# Altium schematic sheet Charging_sch.SchDoc
size A4; SheetNumber: 1; SheetTotal: 1
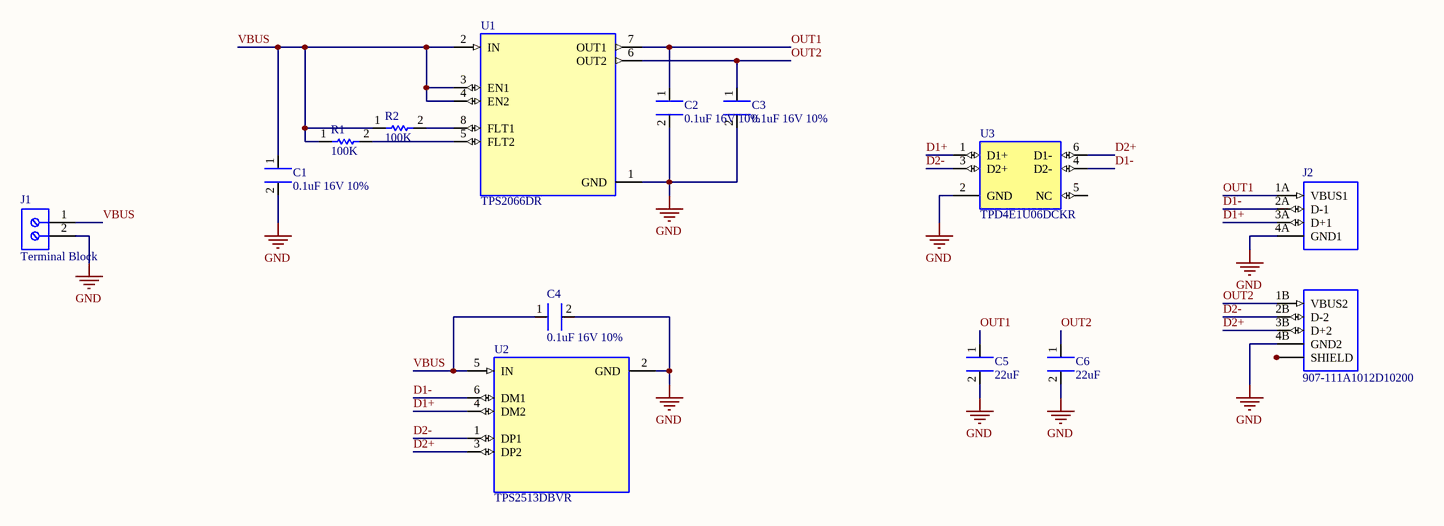
[diagram p0: Charging_sch.SchDoc]

## Parts
C1  0.1uF 16V 10%  [CC0805KRX7R9BB104]
C2  0.1uF 16V 10%  [CC0805KRX7R9BB104]
C3  0.1uF 16V 10%  [CC0805KRX7R9BB104]
C4  0.1uF 16V 10%  [CC0805KRX7R9BB104]
C5  22uF  [RVT1C220M0405]
C6  22uF  [RVT1C220M0405]
J1  Terminal Block  [Terminal Block]
J2  907-111A1012D10200  [907-111A1012D10200]
R1  100K  [ARG05FTC1003]
R2  100K  [ARG05FTC1003]
U1  TPS2066DR  [TPS2066DR]
U2  TPS2513DBVR  [TPS2513DBVR]
U3  TPD4E1U06DCKR  [TPD4E1U06DCKR]

## Nets
GND: C1.2 C2.2 C3.2 C4.2 C5.2 C6.2 J1.2 J2.4A(GND1) J2.4B(GND2) U1.1(GND) U2.2(GND) U3.2(GND)
D1+: J2.3A(D+1) U2.4(DM2) U3.1(D1+)
D1-: J2.2A(D-1) U2.6(DM1) U3.4(D2-)
D2+: J2.3B(D+2) U2.3(DP2) U3.6(D1-)
D2-: J2.2B(D-2) U2.1(DP1) U3.3(D2+)
OUT1: C2.1 C5.1 J2.1A(VBUS1) U1.7(OUT1)
OUT2: C3.1 C6.1 J2.1B(VBUS2) U1.6(OUT2)
VBUS: C1.1 C4.1 J1.1 R1.1 R2.1 U1.2(IN) U1.3(EN1) U1.4(EN2) U2.5(IN)
NetJ2_9: J2.9(SHIELD) J2.10(SHIELD) J2.11(SHIELD) J2.12(SHIELD)
NetR1_2: R1.2 U1.5(FLT2)
NetR2_2: R2.2 U1.8(FLT1)

Not connected (* = marked no-connect by the designer): U3 5(NC)

## Library data of the parts
C1-C4 = CC0805KRX7R9BB104: 贴片电容（MLCC） 100nF ±10% 50V X7R 0805; Manufacturer: Yageo; Material: Ceramic; Insulation Resistance: 100GR; Supplier 1: Digi-Key; Manufacturer Part Number: CC0805KRX7R9BB104; RoHS: Yes; Category: Ceramic Capacitors; Stock 1: 10785221; Pricing 1: 4000=0.01864, 8000=0.01734, 12000=0.01647, 28000=0.01560, 100000=0.01181 (USD); Mount: Surface Mount; Case/Package: 0805; Number of Pins: 2; Case Code (Metric): 2012; Case Code (Imperial): 0805; Min Operating Temperature: -55°C; Max Operating Temperature: 125°C; Tolerance: 10%; Dielectric: X7R; Capacitance: 100nF; Voltage: 50V; Packaging: Tape and Reel; Voltage Rating: 50V; Package Quantity: 1; Termination: SMD/SMT; Series: CC; Length: 2mm; Width: 0.049inch; Height: 0.85mm; Depth: 1.25mm; Thickness: 0.033inch; Radiation Hardening: No; RoHS Compliant: Yes; REACH SVHC: No SVHC; Lead Free: Lead Free; Halogen Free: Halogen Free; ComponentLink1URL: https://datasheet.ciiva.com/11786/0900766b80d84f1d-11786009.pdf?src-supplier=RSComponents; ComponentLink1Description: https://datasheet.ciiva.com/11786/0900766b80d84f1d-11786009.pdf?src-supplier=RSComponents; ComponentLink2URL: https://datasheet.ciiva.com/28450/1489800-28450805.pdf?src-supplier=Element14; ComponentLink2Description: https://datasheet.ciiva.com/28450/1489800-28450805.pdf?src-supplier=Element14; ComponentLink3URL: https://datasheet.ciiva.com/46393/1734573-46393307.pdf?src-supplier=Element14; ComponentLink3Description: https://datasheet.ciiva.com/46393/1734573-46393307.pdf?src-supplier=Element14; ComponentLink4URL: https://datasheet.ciiva.com/155/mlccorderingcode-155930.pdf?src-supplier=Digi-Key; ComponentLink4Description: https://datasheet.ciiva.com/155/mlccorderingcode-155930.pdf?src-supplier=Digi-Key; ComponentLink5URL: https://datasheet.ciiva.com/155/mlccorderingcode-155929.pdf?src-supplier=Digi-Key; ComponentLink5Description: https://datasheet.ciiva.com/155/mlccorderingcode-155929.pdf?src-supplier=Digi-Key; ComponentLink6URL: https://datasheet.ciiva.com/155/mlccorderingcode-155931.pdf?src-supplier=Digi-Key; ComponentLink6Description: https://datasheet.ciiva.com/155/mlccorderingcode-155931.pdf?src-supplier=Digi-Key; ComponentLink7URL: https://datasheet.ciiva.com/11464/upy-gphc-x7r-6-3v-to-50v-8-11464757.pdf?src-supplier=Avnet; ComponentLink7Description: https://datasheet.ciiva.com/11464/upy-gphc-x7r-6-3v-to-50v-8-11464757.pdf?src-supplier=Avnet; ComponentLink8URL: https://datasheet.ciiva.com/16625/upy-gphc-x7r-6-3v-to-50v-8-16625549.pdf?src-supplier=Avnet+Europe; ComponentLink8Description: https://datasheet.ciiva.com/16625/upy-gphc-x7r-6-3v-to-50v-8-16625549.pdf?src-supplier=Avnet+Europe; ComponentLink9URL: https://datasheet.ciiva.com/29242/445210-da-01-en-kerko-chip-0805-x7r-0-1uf-10proz-50vg-29242074.pdf?src-supplier=Conrad; ComponentLink9Description: https://datasheet.ciiva.com/29242/445210-da-01-en-kerko-chip-0805-x7r-0-1uf-10proz-50vg-29242074.pdf?src-supplier=Conrad; Supplier Part Number 1: 311-1140-2-ND
C5 C6 = RVT1C220M0405: Manufacturer: ROQANG; Capacitance: 22uF; Manufacturer Part Number: RVT1C220M0405
J1 = 691709710302: Conn Terminal Block F 2 POS 5mm Solder RA SMD 6A T/R; Manufacturer: Wurth Electronics Midcom; Plating: Steel; Voltage Rating: 300V; Number of Levels: 1; Number of Positions Per Level: 2; Connector Type: Screw; Wire Gauge (Max): 30AWG; Wire Gauge (Min): 14AWG; Pitch: 0.197inch; Supplier 1: Digi-Key; Manufacturer Part Number: 691709710302; RoHS: Yes; Category: Terminal Blocks; Stock 1: 1256; Pricing 1: 1=2.89000, 10=2.56200, 50=2.41200, 100=2.26000 (USD); Mount: Surface Mount; Color: Black; Contact Plating: Tin; Housing Material: Nylon; Min Operating Temperature: -40°C; Max Operating Temperature: 115°C; Package Quantity: 1; Packaging: Tape and Reel; Current Rating: 6A; Current: 6A; Voltage: 300V; Termination: Screw; Number of Positions: 2; Number of Contacts: 2; Wire/Cable Gauge: 30AWG; REACH SVHC: Unknown; Flammability Rating: UL94 V-0; RoHS Compliant: Yes; ComponentLink1URL: http://www.mouser.com/ds/2/445/6917097103xx-271684.pdf?src-supplier=Mouser; ComponentLink1Description: http://www.mouser.com/ds/2/445/6917097103xx-271684.pdf?src-supplier=Mouser; ComponentLink2URL: http://katalog.we-online.de/em/datasheet/6917097103xx.pdf?src-supplier=Digi-Key; ComponentLink2Description: http://katalog.we-online.de/em/datasheet/6917097103xx.pdf?src-supplier=Digi-Key; ComponentLink3URL: https://katalog.we-online.de/em/datasheet/6917097103xx.pdf?src-supplier=Digi-Key; ComponentLink3Description: https://katalog.we-online.de/em/datasheet/6917097103xx.pdf?src-supplier=Digi-Key; ComponentLink4URL: http://www.farnell.com/cad/1804164.pdf?src-supplier=Element14; ComponentLink4Description: http://www.farnell.com/cad/1804164.pdf?src-supplier=Element14; Supplier Part Number 1: 1297-1108-1-ND
J2 = 907-111A1012D10200: USB1035 Series 8 Position Dual Port Through Hole USB; Manufacturer: Jing Extension of the Electronic Co.; Supplier 1: Digi-Key; Manufacturer Part Number: 907-111A1012D10200; RoHS: Yes; Category: USB Connectors; Contact Material: Brass; Contact Plating: Gold; Orientation: Right Angle; Connector Type: USB; RoHS Compliant: Yes; Supplier Part Number 1: 2073-USB1035-GF-P-0-B-B-ND
R1 R2 = ARG05FTC1003: Manufacturer: Viking Tech; Voltage Rating: 100V; Resistance: 100K; Manufacturer part number: ARG05FTC1003
U1 = TPS2066DR: Dual 1A, active-high, current-limited, power-distribution switches 8-SOIC -40 to 85; Manufacturer: Texas Instruments; Number of Outputs: 2; Min Supply Voltage: 2.7V; Max Supply Voltage: 5.5V; Interface: On/Off; Fault Protection: Over Temperature; Output Configuration: High Side; Supplier 1: Digi-Key; Manufacturer Part Number: TPS2066DR; RoHS: Yes; Category: Hot Swap Controllers; Stock 1: 1325; Pricing 1: 1=1.61000, 10=1.44400, 25=1.36200, 100=1.16050, 250=1.08968, 500=0.95348, 1000=0.89950 (USD); Case/Package: D; Number of Pins: 8; Weight: 0.002561oz; Min Operating Temperature: -40°C; Max Operating Temperature: 85°C; Packaging: Tape and Reel; Package Quantity: 2500; Max Input Voltage: 5.5V; Min Input Voltage: 2.7V; Series: -; Number of Switches: 2; Max Output Current: 1A; Radiation Hardening: No; Lead Free: Lead Free; RoHS Compliant: Yes; ComponentLink1URL: https://datasheet.ciiva.com/15108/getdatasheetpartid-322117-15108532.pdf?src-supplier=Verical; ComponentLink1Description: https://datasheet.ciiva.com/15108/getdatasheetpartid-322117-15108532.pdf?src-supplier=Verical; ComponentLink2URL: https://datasheet.ciiva.com/1962/tps2061-1962580.pdf?src-supplier=Digi-Key; ComponentLink2Description: https://datasheet.ciiva.com/1962/tps2061-1962580.pdf?src-supplier=Digi-Key; ComponentLink3URL: https://datasheet.ciiva.com/1962/tps2061-1962581.pdf?src-supplier=Digi-Key; ComponentLink3Description: https://datasheet.ciiva.com/1962/tps2061-1962581.pdf?src-supplier=Digi-Key; ComponentLink4URL: https://datasheet.ciiva.com/1962/tps2061-1962582.pdf?src-supplier=Digi-Key; ComponentLink4Description: https://datasheet.ciiva.com/1962/tps2061-1962582.pdf?src-supplier=Digi-Key; Supplier Part Number 1: 296-28004-1-ND
U2 = TPS2513DBVR: USB Charging Port Controller Dual 5.5V 6-Pin SOT-23 T/R / IC USB PWR SW/CTRLR CHRG SOT23-6; Manufacturer: Texas Instruments; Min Input Voltage: 4.5V; Output Current: 35mA; Operating Supply Current: 155uA; Number of Outputs: 2; Max Supply Current: 200uA; Supplier 1: Digi-Key; Manufacturer Part Number: TPS2513DBVR; RoHS: Yes; Category: Power Management ICs; Pricing 1: 1=1.79000, 10=1.60700, 25=1.51600, 100=1.29150, 250=1.21264, 500=1.06106, 1000=1.00100 (USD); Mount: Surface Mount; Case/Package: SOT-23-6; Number of Pins: 6; Min Operating Temperature: -40°C; Max Operating Temperature: 125°C; Packaging: Tape and Reel; Package Quantity: 3000; Max Input Voltage: 5.5V; Operating Supply Voltage: 5.5V; Radiation Hardening: No; Lead Free: Lead Free; RoHS Compliant: Yes; ComponentLink1URL: https://datasheet.ciiva.com/29590/tps2514a-29590179.pdf?src-supplier=Digi-Key; ComponentLink1Description: https://datasheet.ciiva.com/29590/tps2514a-29590179.pdf?src-supplier=Digi-Key; ComponentLink2URL: https://datasheet.ciiva.com/26909/getdatasheetpartid-741816-26909231.pdf?src-supplier=Verical; ComponentLink2Description: https://datasheet.ciiva.com/26909/getdatasheetpartid-741816-26909231.pdf?src-supplier=Verical; Supplier Part Number 1: 296-37668-1-ND
U3 = TPD4E1U06DCKR: TVS DIODE 5.5VWM 15VC SC70-6; Manufacturer: Texas Instruments; Direction: Unidirectional; Capacitance: 1pF; Operating Supply Voltage: 5.5V; Polarity: Bidirectional; Number of Bidirectional Channels: 4; Min Breakdown Voltage: 6.5V; Clamping Voltage: 11V; Peak Pulse Power: 45W; Power Line Protection: Yes; Test Current: 1mA; Max Reverse Leakage Current: 10nA; Peak Pulse Current: 3A; Interface: LVDS,USB,Ethernet; Supplier 1: Digi-Key; Supplier Part Number 1: 296-39347-1-ND; Manufacturer Part Number: TPD4E1U06DCKR; RoHS: Yes; Category: Integrated Circuits (ICs); Pricing 1: 1=0.49000, 10=0.39900, 100=0.27140, 500=0.20352, 1000=0.15264 (USD); Mount: Surface Mount; Case/Package: SC; Number of Pins: 6; Min Operating Temperature: -40°C; Max Operating Temperature: 125°C; Package Quantity: 3000; Packaging: Tape and Reel; Reverse Standoff Voltage: 5.5V; Breakdown Voltage: 6.5V; Number of Channels: 4; Termination: SMD/SMT; ESD Protection: Yes; Working Voltage: 5.5V; Max Power Dissipation: 45W; Series: -; Length: 2.15mm; Width: 1.4mm; Height: 1mm; REACH SVHC: No SVHC; Lead Free: Lead Free; RoHS Compliant: Yes; ComponentLink1URL: https://datasheet.ciiva.com/12545/tpd4e1u06-224689-12545136.pdf?src-supplier=Mouser; ComponentLink1Description: https://datasheet.ciiva.com/12545/tpd4e1u06-224689-12545136.pdf?src-supplier=Mouser; ComponentLink2URL: https://datasheet.ciiva.com/6574/tpd4e1u06-6574672.pdf?src-supplier=Digi-Key; ComponentLink2Description: https://datasheet.ciiva.com/6574/tpd4e1u06-6574672.pdf?src-supplier=Digi-Key